# EAGLE design headerboard (EAGLE 5.11)
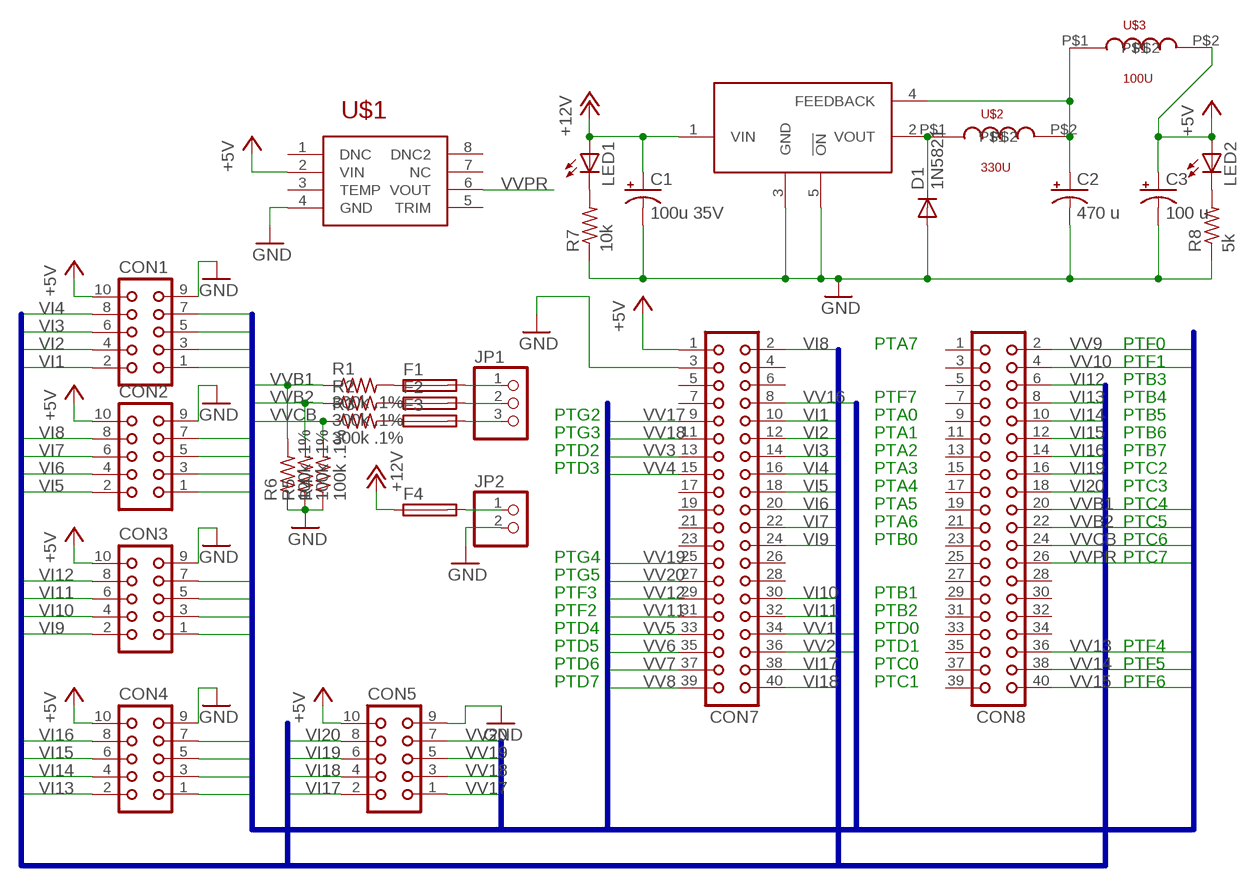
[diagram p0: schematic, sheet 1]

## Parts
C1  100u 35V  CPOL-USE2.5-6  [E2,5-6]
C2  470 u  CPOL-USE5-10.5  [E5-10,5]
C3  100 u  CPOL-USE2.5-6  [E2,5-6]
CON1  CON10  [CON10]
CON2  CON10  [CON10]
CON3  CON10  [CON10]
CON4  CON10  [CON10]
CON5  CON10  [CON10]
CON7  CON40  [CON40]
CON8  CON40  [CON40]
D1  1N5821  UF5400  [DO201-15]
F1  FUSETE5  [TE5]
F2  FUSETE5  [TE5]
F3  FUSETE5  [TE5]
F4  FUSETE5  [TE5]
JP1  PINHD-1X3  [1X03]
JP2  PINHD-1X2  [1X02]
LED1  LEDCHIPLED_1206  [CHIPLED_1206]
LED2  LEDCHIPLED_1206  [CHIPLED_1206]
R1  300k .1%  R-US_R0603  [R0603]
R2  300k .1%  R-US_R0603  [R0603]
R3  300k .1%  R-US_R0603  [R0603]
R4  100k .1%  R-US_R0603  [R0603]
R5  100k .1%  R-US_R0603  [R0603]
R6  100k .1%  R-US_R0603  [R0603]
R7  10k  R-US_R0603  [R0603]
R8  5k  R-US_R0603  [R0603]
TL257505  TL2575  [TO-263]
U$1  REF5030  [SOIC]
U$2  330U  PE-526  [PE-526]
U$3  100U  PE-526  [PE-526]

## Nets
+5V: C3.+ CON1.10 CON2.10 CON3.10 CON4.10 CON5.10 CON7.1 LED2.A U$1.2(VIN) U$3.P$2
+12V: C1.+ F4.1 LED1.A TL257505.1(VIN)
GND: C1.- C2.- C3.- CON1.9 CON2.9 CON3.9 CON4.9 CON5.9 CON7.3 D1.A JP2.2 R4.1 R5.1 R6.1 R7.1 R8.1 TL257505.3(GND) TL257505.5(!ON) U$1.4(GND)
N$1: F1.2 JP1.1
N$2: F2.2 JP1.2
N$3: F3.2 JP1.3
N$4: F1.1 R1.2
N$5: F2.1 R2.2
N$6: F3.1 R3.2
N$7: F4.2 JP2.1
N$8: LED2.C R8.2
N$9: LED1.C R7.2
N$10: D1.C TL257505.2(VOUT) U$2.P$1
N$13: C2.+ TL257505.4(FEEDBACK) U$2.P$2 U$3.P$1
VI1: CON1.2 CON7.10
VI2: CON1.4 CON7.12
VI3: CON1.6 CON7.14
VI4: CON1.8 CON7.16
VI5: CON2.2 CON7.18
VI6: CON2.4 CON7.20
VI7: CON2.6 CON7.22
VI8: CON2.8 CON7.2
VI9: CON3.2 CON7.24
VI10: CON3.4 CON7.30
VI11: CON3.6 CON7.32
VI12: CON3.8 CON8.6
VI13: CON4.2 CON8.8
VI14: CON4.4 CON8.10
VI15: CON4.6 CON8.12
VI16: CON4.8 CON8.14
VI17: CON5.2 CON7.38
VI18: CON5.4 CON7.40
VI19: CON5.6 CON8.16
VI20: CON5.8 CON8.18
VV1: CON1.1 CON7.34
VV2: CON1.3 CON7.36
VV3: CON1.5 CON7.13
VV4: CON1.7 CON7.15
VV5: CON2.1 CON7.33
VV6: CON2.3 CON7.35
VV7: CON2.5 CON7.37
VV8: CON2.7 CON7.39
VV9: CON3.1 CON8.2
VV10: CON3.3 CON8.4
VV11: CON3.5 CON7.31
VV12: CON3.7 CON7.29
VV13: CON4.1 CON8.36
VV14: CON4.3 CON8.38
VV15: CON4.5 CON8.40
VV16: CON4.7 CON7.8
VV17: CON5.1 CON7.9
VV18: CON5.3 CON7.11
VV19: CON5.5 CON7.25
VV20: CON5.7 CON7.27
VVB1: CON8.20 R1.1 R6.2
VVB2: CON8.22 R2.1 R5.2
VVCB: CON8.24 R3.1 R4.2
VVPR: CON8.26 U$1.6(VOUT)
Unconnected: CON7.4 CON7.5 CON7.6 CON7.7 CON7.17 CON7.19 CON7.21 CON7.23 CON7.26 CON7.28 CON8.1 CON8.3 CON8.5 CON8.7 CON8.9 CON8.11 CON8.13 CON8.15 CON8.17 CON8.19 CON8.21 CON8.23 CON8.25 CON8.27 CON8.28 CON8.29 CON8.30 CON8.31 CON8.32 CON8.33 CON8.34 CON8.35 CON8.37 CON8.39 U$1.1(DNC) U$1.3(TEMP) U$1.5(TRIM) U$1.7(NC) U$1.8(DNC2)

## Buses
VI[1..20]
VV[1..20],VVB[1..2],VVCB,VVPR

## Notes on the sheet
- PTA7 | PTF0
- PTF1
- PTB3
- PTF7 | PTB4
- PTG2 | PTA0 | PTB5
- PTG3 | PTA1 | PTB6
- PTD2 | PTA2 | PTB7
- PTD3 | PTA3 | PTC2
- PTA4 | PTC3
- PTA5 | PTC4
- PTA6 | PTC5
- PTB0 | PTC6
- PTG4 | PTC7
- PTG5
- PTF3 | PTB1
- PTF2 | PTB2
- PTD4 | PTD0
- PTD5 | PTD1 | PTF4
- PTD6 | PTC0 | PTF5
- PTD7 | PTC1 | PTF6

## Library data of the parts
C1-C3 = rcl:CPOL-US: POLARIZED CAPACITOR, American symbol
CON1-CON5 = con-harting:CON10: CONNECTOR; OC_FARNELL: unknown; OC_NEWARK: unknown
CON7 CON8 = con-harting:CON40: CONNECTOR; OC_FARNELL: unknown; OC_NEWARK: unknown
D1 = diode:UF5400: DIODE ultra fast rectifier, 3 A
F1-F4 = fuse:FUSE: Fuse; OC_FARNELL: unknown; OC_NEWARK: unknown
JP1 = pinhead:PINHD-1X3: PIN HEADER
JP2 = pinhead:PINHD-1X2: PIN HEADER
LED1 LED2 = led:LED: LED OSRAM: - CHIPLED LG R971, LG N971, LY N971, LG Q971, LY Q971, LO R971, LY R971 LH N974, LH R974 LS Q976, LO Q976, LY Q976 LO Q996 - Hyper CHIPLED LW Q18S LB Q993, LB Q99A, LB R99A - SideLED LS A670, LO A670, LY A670, LG A670, LP A670 LB A673, LV A673, LT A673, LW A673 LH A674 LY A675 LS A676, LA A676, LO A676, LY A676, LW A676 LS A679, LY A679, LG A679 - Hyper Micro SIDELED® LS Y876, LA Y876, LO Y876, LY Y876 LT Y87S - SmartLED LW L88C, LW L88S LB L89C, LB L89S, LG L890 LS L89K, LO L89K, LY L89K LS L896, LA L896, LO L896, LY L896 - TOPLED LS T670, LO T670, LY T670, LG T670, LP T670 LSG T670, LSP T670, LSY T670, LOP T670, LYG T670 LG T671, LOG T671, LSG T671 LB T673, LV T673, LT T673, LW T673 LH T674 LS T676, LA T676, LO T676, LY T676, LB T676, LH T676, LSB T676, LW T676 LB T67C, LV T67C, LT T67C, LS T67K, LO T67K, LY T67K, LW E67C LS E67B, LA E67B, LO E67B, LY E67B, LB E67C, LV E67C, LT E67C LW T67C LS T679, LY T679, LG T679 LS T770, LO T770, LY T770, LG T770, LP T770 LB T773, LV T773, LT T773, LW T773 LH T774 LS E675, LA E675, LY E675, LS T675 LS T776, LA T776, LO T776, LY T776, LB T776 LHGB T686 LT T68C, LB T68C - Hyper Mini TOPLED® LB M676 - Mini TOPLED Santana® LG M470 LS M47K, LO M47K, LY M47K Source: http://www.osram.convergy.de LUXEON: - LUMILED® LXK2-PW12-R00, LXK2-PW12-S00, LXK2-PW14-U00, LXK2-PW14-V00 LXK2-PM12-R00, LXK2-PM12-S00, LXK2-PM14-U00 LXK2-PE12-Q00, LXK2-PE12-R00, LXK2-PE12-S00, LXK2-PE14-T00, LXK2-PE14-U00 LXK2-PB12-K00, LXK2-PB12-L00, LXK2-PB12-M00, LXK2-PB14-N00, LXK2-PB14-P00, LXK2-PB14-Q00 LXK2-PR12-L00, LXK2-PR12-M00, LXK2-PR14-Q00, LXK2-PR14-R00 LXK2-PD12-Q00, LXK2-PD12-R00, LXK2-PD12-S00 LXK2-PH12-R00, LXK2-PH12-S00 LXK2-PL12-P00, LXK2-PL12-Q00, LXK2-PL12-R00 Source: www.luxeon.com KINGBRIGHT: KA-3528ASYC Source: www.kingbright.com
R1-R8 = rcl:R-US_: RESISTOR, American symbol
TL257505 = lee:TL2575
U$1 = lee:REF5030
U$2 U$3 = lee:PE-526

## Board
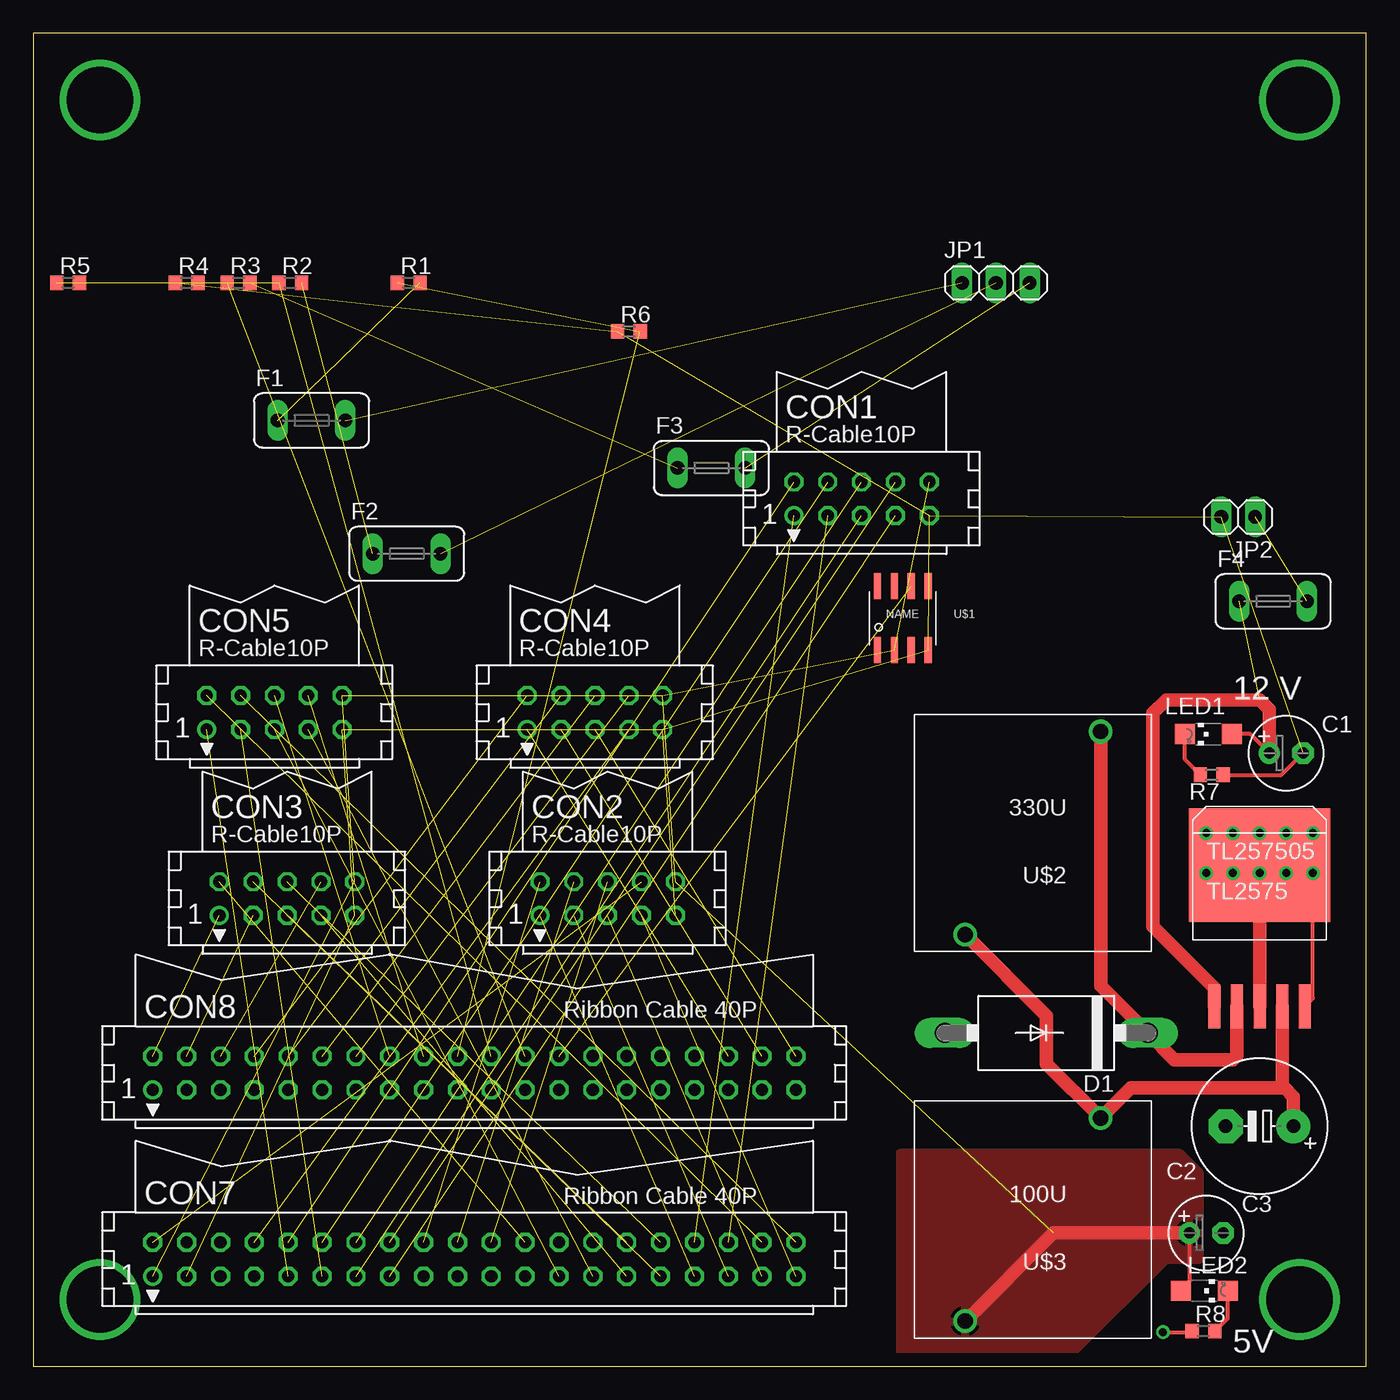
[diagram p1: board, top side]
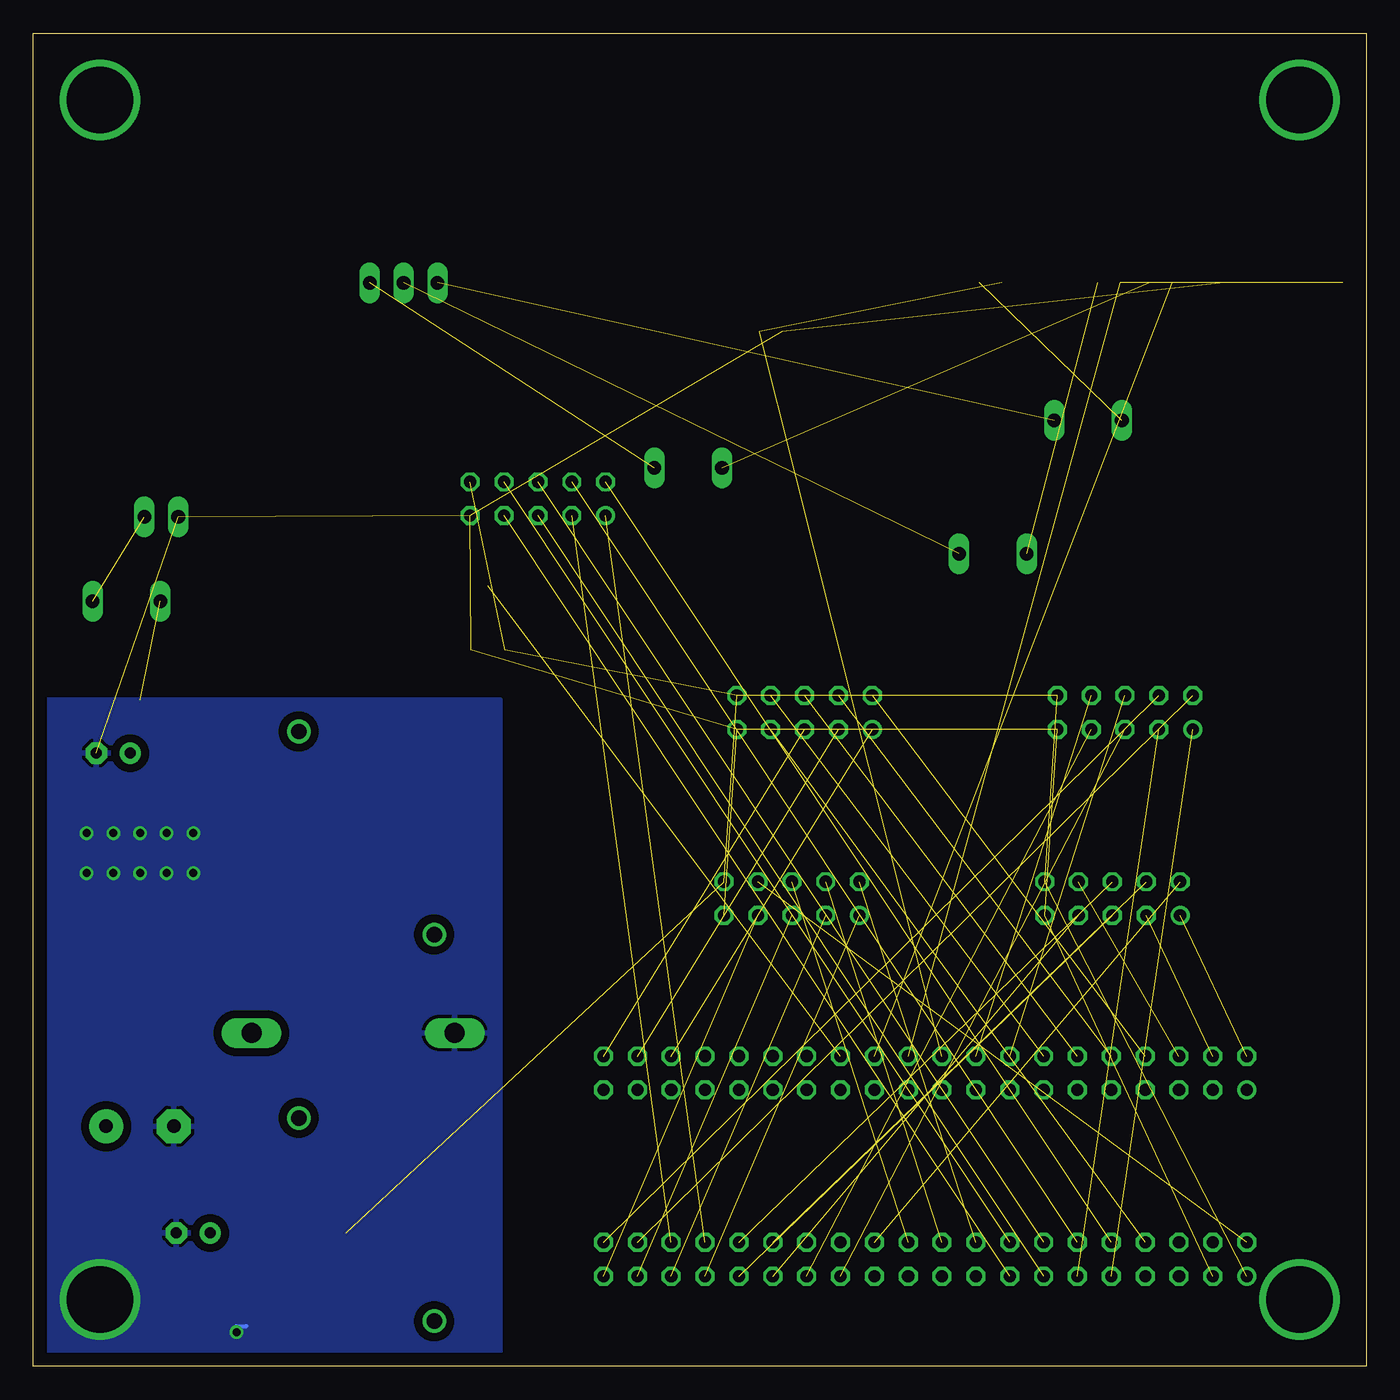
[diagram p2: board, bottom side, seen from below]

Size 100 x 100 mm. Coordinates in mm from the lower left corner, seen from the top.
Outline: 0,0 100,0 100,100 0,100 0,0
Copper layers (1*16): Top 0.035mm / dielectric 1.5mm / Bottom 0.035mm
Design rules "default": minimum track width 10mil, minimum drill 24mil, track to track 8mil, track to pad 8mil, pad to pad 8mil, via to via 8mil, smd to smd 8mil, copper to edge 40mil, drill to drill 8mil, minimum pad ring 10mil, minimum via ring 8mil, stop-mask expansion 4mil, vias tented up to drill 0mil, thermal gap 10mil

### Footprints (pad centres in the part's own frame; a part is rotated, then mirrored left to right if it is on the bottom)
E2,5-6 = drill 0.813 pad 1.6 round: + -1.27,0 | drill 0.813 pad 1.6 octagon: - 1.27,0
E5-10,5 = drill 1.016 pad 2.54 round: + -2.54,0 | drill 1.016 pad 2.54 octagon: - 2.54,0
CON10 = drill 0.914 round: 1 -5.08,-1.27 | drill 0.914 octagon: 2 -5.08,1.27; 3 -2.54,-1.27; 4 -2.54,1.27; 5 0,-1.27; 6 0,1.27; 7 2.54,-1.27; 8 2.54,1.27; 9 5.08,-1.27; 10 5.08,1.27
CON40 = drill 0.914 round: 1 -24.13,-1.27 | drill 0.914 octagon: 2 -24.13,1.27; 3 -21.59,-1.27; 4 -21.59,1.27; 5 -19.05,-1.27; 6 -19.05,1.27; 7 -16.51,-1.27; 8 -16.51,1.27; 9 -13.97,-1.27; 10 -13.97,1.27; 11 -11.43,-1.27; 12 -11.43,1.27; 13 -8.89,-1.27; 14 -8.89,1.27; 15 -6.35,-1.27; 16 -6.35,1.27; 17 -3.81,-1.27; 18 -3.81,1.27; 19 -1.27,-1.27; 20 -1.27,1.27; 21 1.27,-1.27; 22 1.27,1.27; 23 3.81,-1.27; 24 3.81,1.27; 25 6.35,-1.27; 26 6.35,1.27; 27 8.89,-1.27; 28 8.89,1.27; 29 11.43,-1.27; 30 11.43,1.27; 31 13.97,-1.27; 32 13.97,1.27; 33 16.51,-1.27; 34 16.51,1.27; 35 19.05,-1.27; 36 19.05,1.27; 37 21.59,-1.27; 38 21.59,1.27; 39 24.13,-1.27; 40 24.13,1.27
DO201-15 = drill 1.499 long: A 7.62,0; C -7.62,0
TE5 = drill 1.016 long: 1 -2.54,0; 2 2.54,0
1X03 = drill 1.016 long: 1 -2.54,0; 2 0,0; 3 2.54,0
1X02 = drill 1.016 long: 1 -1.27,0; 2 1.27,0
CHIPLED_1206 = smd 1.5 x 1.5: A 0,-1.75; C 0,1.75
R0603 = smd 1 x 1.1: 1 -0.85,0; 2 0.85,0
TO-263 = smd 0.9 x 3.3: 1 -3.4,0; 2 -1.7,0; 3 0,0; 4 1.7,0; 5 3.4,0 | smd 10.6 x 8.5: P$2 0,10.6
SOIC = smd 0.55 x 1.95: 1 -1.9,-2.4; 2 -0.63,-2.4; 3 0.64,-2.4; 4 1.91,-2.4; 5 1.91,2.4; 6 0.64,2.4; 7 -0.63,2.4; 8 -1.9,2.4
PE-526 = drill 1.143 pad 1.778 round: P$1 -5.08,-7.62; P$2 5.08,7.62

### Placement (x,y rotation side)
C1  94,46 0 top
C2  92,18 180 top
C3  88,10 0 top
CON1  62.14,65.08 0 top
CON2  43.09,35.08 0 top
CON3  19.04,35.08 0 top
CON4  42.14,49.05 0 top
CON5  18.09,49.05 0 top
CON7  33.09,8.02 0 top
CON8  33.09,21.99 0 top
D1  76,25 180 top
F1  20.87,70.96 0 top
F2  28.01,60.96 0 top
F3  50.87,67.39 0 top
F4  93.01,57.39 0 top
JP1  72.22,81.28 0 top
JP2  90.4,63.72 180 top
LED1  88.15,47.42 90 top
LED2  87.85,5.66 270 top
R1  28.17,81.28 0 top
R2  19.28,81.28 0 top
R3  15.39,81.28 0 top
R4  11.5,81.28 0 top
R5  2.61,81.28 0 top
R6  44.68,77.63 0 top
R7  88.4,44.37 180 top
R8  87.79,2.63 0 top
TL257505  92,27 0 top
U$1  65.23,56.12 0 top
U$2  75,40 180 top
U$3  75,11 180 top

### Tracks (layer width: path | path; a pad name or v marks a point on that pad's centre or on a via)
+5V  (7 unrouted)
  Top 0.305: LED2.A 86.73,6.29 C3.+
  Top 1.016: U$3.P$2 76.54,10 C3.+
  pour Top (isolate 0.61): 86,16 65,16 65,1 78,1 85,8 87.5,8 87.5,14.5
+12V  (1 unrouted)
  Top 0.305: LED1.A 91.31,47.42 C1.+
  Top 1.016: TL257505.1 88.6,28.4 84,33 84,49 85,50 92,50 92.73,49.27 C1.+
GND  (via drill 0.6, 5)  (11 unrouted)
  Top 0.305: R7.1 93.64,44.37 C1.- | TL257505.5 96,27.6 v96,37 | R8.1 86.94,2.55 v84.75,2.55
  Top 1.016: TL257505.3 v92,37
  Bottom 0.305: v84.75,2.55 84.75,3 84,3
  other vias: 95,5 88,40 90,40 92,40 94,40 96,40 88,37 90,37 94,37
  pour Bottom (isolate 0.61): 65,50 99,50 99,1 65,1
N$1  (1 unrouted)
N$2  (1 unrouted)
N$3  (1 unrouted)
N$4  (1 unrouted)
N$5  (1 unrouted)
N$6  (1 unrouted)
N$7  (1 unrouted)
N$8
  Top 0.305: R8.2 89.6,3.59 LED2.C
N$9
  Top 0.305: LED1.C 86.4,45.52 R7.2
N$10
  Top 1.016: U$2.P$1 80.08,28.54 D1.C 85.62,23 90,23 90.3,23.3 TL257505.2
N$13
  Top 1.016: TL257505.4 93.7,21.05 93.88,20.88 | 93.88,20.88 94.54,20.21 C2.+ | 93.88,20.88 82.33,20.88 U$3.P$1 76,22.7 76,26.3 U$2.P$2
N$14  (via drill 5)
  other vias: 5,5
N$15  (via drill 5)
  other vias: 5,95
N$16  (via drill 5)
  other vias: 95,95
VI1  (1 unrouted)
VI2  (1 unrouted)
VI3  (1 unrouted)
VI4  (1 unrouted)
VI5  (1 unrouted)
VI6  (1 unrouted)
VI7  (1 unrouted)
VI8  (1 unrouted)
VI9  (1 unrouted)
VI10  (1 unrouted)
VI11  (1 unrouted)
VI12  (1 unrouted)
VI13  (1 unrouted)
VI14  (1 unrouted)
VI15  (1 unrouted)
VI16  (1 unrouted)
VI17  (1 unrouted)
VI18  (1 unrouted)
VI19  (1 unrouted)
VI20  (1 unrouted)
VV1  (1 unrouted)
VV2  (1 unrouted)
VV3  (1 unrouted)
VV4  (1 unrouted)
VV5  (1 unrouted)
VV6  (1 unrouted)
VV7  (1 unrouted)
VV8  (1 unrouted)
VV9  (1 unrouted)
VV10  (1 unrouted)
VV11  (1 unrouted)
VV12  (1 unrouted)
VV13  (1 unrouted)
VV14  (1 unrouted)
VV15  (1 unrouted)
VV16  (1 unrouted)
VV17  (1 unrouted)
VV18  (1 unrouted)
VV19  (1 unrouted)
VV20  (1 unrouted)
VVB1  (2 unrouted)
VVB2  (2 unrouted)
VVCB  (2 unrouted)
VVPR  (1 unrouted)

### Text on the board
tNames: 12 V | 5V